# Altium schematic sheet 02_MSP430.SchDoc: Wearable Ultra Low-Power Ultrasound probe
size A3; DrawnBy: Sebastian Frey; Organization: Integrated Systems Laboratory; Revision: v1.2; SheetNumber: 3; SheetTotal: 6
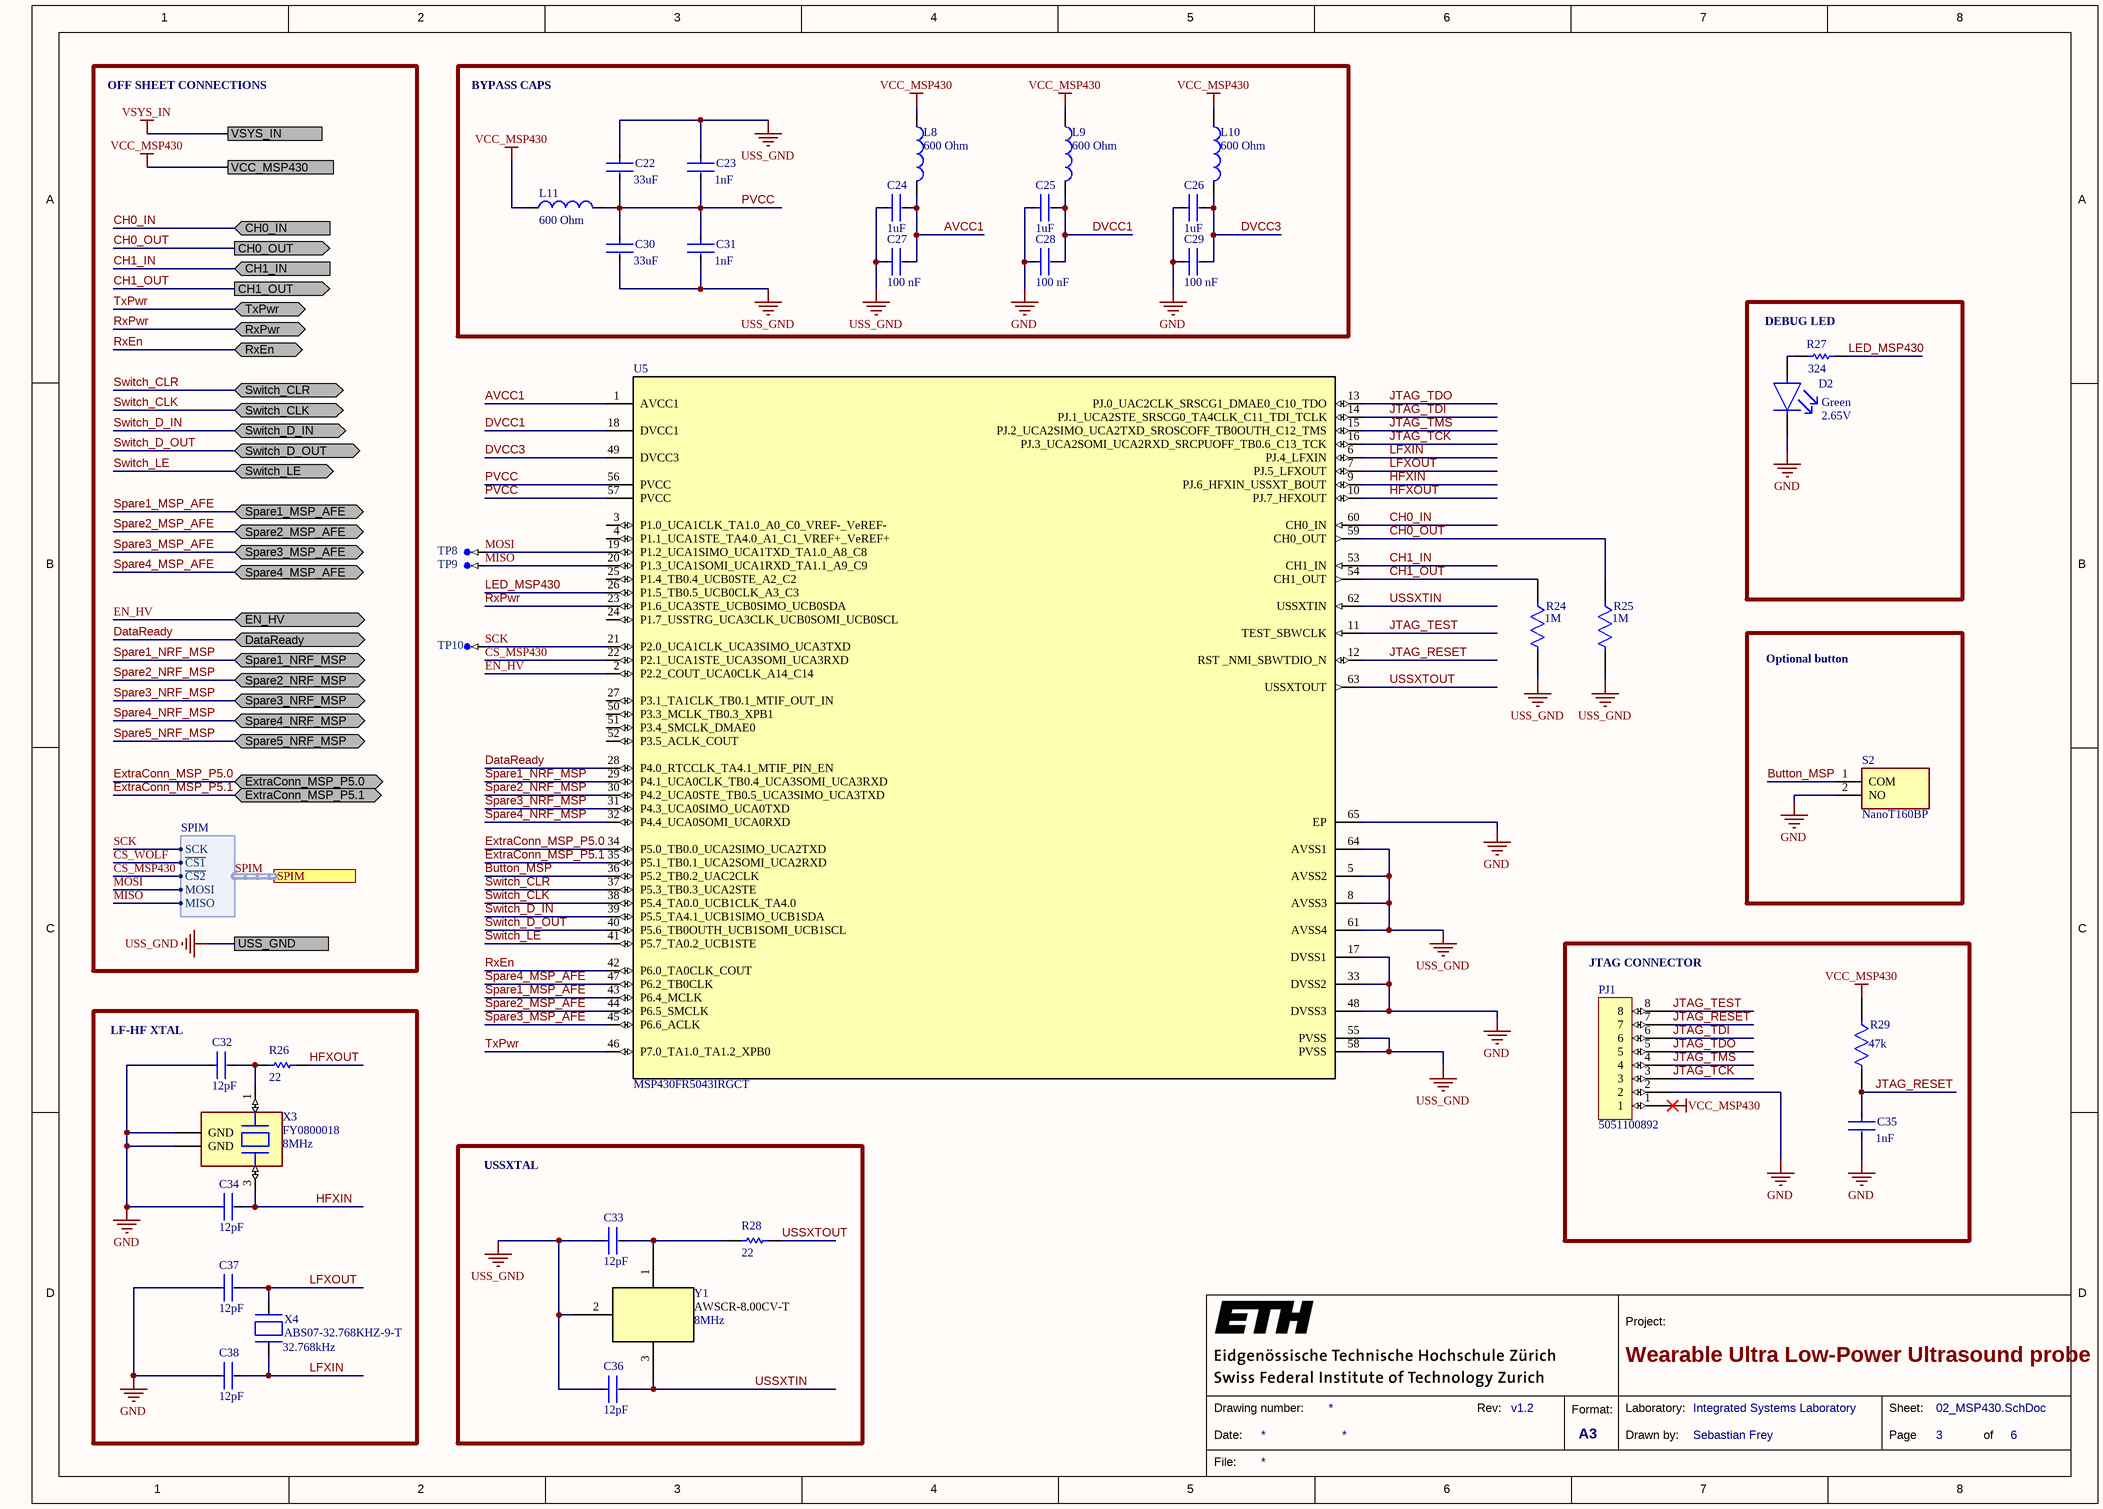
[diagram p0: 02_MSP430.SchDoc]

## Parts
C22  Capacitance: 33uF  [FP-C2012-125-0_2-IPC_A]  (hidden comment: C2012X5R1A336M125AC)
C23  Capacitance: 1nF  [FP-GRM155-0_05-IPC_B]  (hidden comment: GRM1555C1H102JA01D)
C24  Capacitance: 1uF  [FP-C1608-080-0_1-IPC_B]  (hidden comment: C1608X7R1C105K080AC)
C25  Capacitance: 1uF  [FP-C1608-080-0_1-IPC_B]  (hidden comment: C1608X7R1C105K080AC)
C26  Capacitance: 1uF  [FP-C1608-080-0_1-IPC_B]  (hidden comment: C1608X7R1C105K080AC)
C27  value 100 nF  [FP-CC0402-MFG]  (hidden comment: CC0402KRX7R7BB104)
C28  value 100 nF  [FP-CC0402-MFG]  (hidden comment: CC0402KRX7R7BB104)
C29  value 100 nF  [FP-CC0402-MFG]  (hidden comment: CC0402KRX7R7BB104)
C30  Capacitance: 33uF  [FP-C2012-125-0_2-IPC_A]  (hidden comment: C2012X5R1A336M125AC)
C31  Capacitance: 1nF  [FP-GRM155-0_05-IPC_B]  (hidden comment: GRM1555C1H102JA01D)
C32  Capacitance: 12pF  [FP-GJM155-0_05-IPC_A]  (hidden comment: GJM1555C1H120GB01D)
C33  Capacitance: 12pF  [FP-GJM155-0_05-IPC_A]  (hidden comment: GJM1555C1H120GB01D)
C34  Capacitance: 12pF  [FP-GJM155-0_05-IPC_A]  (hidden comment: GJM1555C1H120GB01D)
C35  Capacitance: 1nF  [FP-GRM155-0_05-IPC_B]  (hidden comment: GRM1555C1H102JA01D)
C36  Capacitance: 12pF  [FP-GJM155-0_05-IPC_A]  (hidden comment: GJM1555C1H120GB01D)
C37  Capacitance: 12pF  [FP-GJM155-0_05-IPC_A]  (hidden comment: GJM1555C1H120GB01D)
C38  Capacitance: 12pF  [FP-GJM155-0_05-IPC_A]  (hidden comment: GJM1555C1H120GB01D)
D2  Forward Voltage: 2.65V  Color: Green  [FP-APHD1608LZGCK-MFG]  (hidden comment: APHD1608LZGCK)
L8  Impedance: 600 Ohm  [SMD-0805]  (hidden comment: 742792040)
L9  Impedance: 600 Ohm  [SMD-0805]  (hidden comment: 742792040)
L10  Impedance: 600 Ohm  [SMD-0805]  (hidden comment: 742792040)
L11  Impedance: 600 Ohm  [SMD-0805]  (hidden comment: 742792040)
PJ1  5051100892  [MOLEX_5051100892]
R24  Resistance: 1M  [FP-CRCW0402-e3-MFG]  (hidden comment: CRCW04021M00FKED)
R25  Resistance: 1M  [FP-CRCW0402-e3-MFG]  (hidden comment: CRCW04021M00FKED)
R26  Resistance: 22  [RESC1005X40X25NL05T10]  (hidden comment: RC0402JR-0722RL)
R27  Resistance: 324  [RESC1005X35X20ML05T10]  (hidden comment: CPF0402B324RE1)
R28  Resistance: 22  [RESC1005X40X25NL05T10]  (hidden comment: RC0402JR-0722RL)
R29  Resistance: 47k  [FP-CRCW0402-e3-IPC_C]  (hidden comment: CRCW040247K0FKED)
S2  NanoT160BP  [NanoT160BP]
TP8  TP-SM-C-100  [TP-SM-C-100]  (value not drawn)  (no BOM)
TP9  TP-SM-C-100  [TP-SM-C-100]  (value not drawn)  (no BOM)
TP10  TP-SM-C-100  [TP-SM-C-100]  (value not drawn)  (no BOM)
U5  MSP430FR5043IRGCT  [RGC0064G]
X3  FY0800018  Frequency: 8MHz  [XTAL_ECS-80-18-30B-AGN-TR]
X4  ABS07-32.768KHZ-9-T  Frequency: 32.768kHz  [XTAL320X150X90]
Y1  Frequency: 8MHz  [AWSCR-8.00CV-T_ABR]  (hidden comment: AWSCR-8.00CV-T)

## Blocks framed on the sheet
BYPASS CAPS: C22-C31 L8-L11
DEBUG LED: D2 R27
Optional button: S2
JTAG CONNECTOR: C35 PJ1 R29
LF-HF XTAL: C32 C34 C37 C38 R26 X3 X4
USSXTAL: C33 C36 R28 Y1

## Ports
CH0_IN (in), CH0_OUT (out), CH1_IN (in), CH1_OUT (out), DataReady (bidir), EN_HV (bidir), ExtraConn_MSP_P5.0 (bidir), ExtraConn_MSP_P5.1 (bidir), RxEn (bidir), RxPwr (bidir), Spare1_MSP_AFE (bidir), Spare1_NRF_MSP (bidir), Spare2_MSP_AFE (bidir), Spare2_NRF_MSP (bidir), Spare3_MSP_AFE (bidir), Spare3_NRF_MSP (bidir), Spare4_MSP_AFE (bidir), Spare4_NRF_MSP (bidir), Spare5_NRF_MSP (bidir), SPIM (harness SPIM), Switch_CLK (bidir), Switch_CLR (bidir), Switch_D_IN (bidir), Switch_D_OUT (bidir), Switch_LE (bidir), TxPwr (bidir), USS_GND, VCC_MSP430, VSYS_IN

## Harnesses
SPIM: SCK, ~{CS1}, ~{CS2}, MOSI, MISO

## Nets
GND: C25.2 C26.2 C28.1 C29.1 C32.1 C34.1 C35.2 C37.1 C38.1 D2.1(C) PJ1.2 S2.2(NO) U5.17(DVSS1) U5.33(DVSS2) U5.48(DVSS3) U5.65(EP) X3.2(GND) X3.4(GND)
USS_GND: C22.1 C23.1 C24.2 C27.1 C30.2 C31.2 C33.1 C36.1 R24.2 R25.2 U5.5(AVSS2) U5.8(AVSS3) U5.55(PVSS) U5.58(PVSS) U5.61(AVSS4) U5.64(AVSS1) Y1.2 ; port USS_GND
VCC_MSP430: L8.1 L9.1 L10.1 L11.1 PJ1.1 R29.1 ; port VCC_MSP430
VSYS_IN: port VSYS_IN
AVCC1: C24.1 C27.2 L8.2 U5.1(AVCC1)
Button_MSP: S2.1(COM) U5.36(P5.2_TB0.2_UAC2CLK)
CH0_IN: U5.60(CH0_IN) ; port CH0_IN
CH0_OUT: R25.1 U5.59(CH0_OUT) ; port CH0_OUT
CH1_IN: U5.53(CH1_IN) ; port CH1_IN
CH1_OUT: R24.1 U5.54(CH1_OUT) ; port CH1_OUT
CS_MSP430: U5.22(P2.1_UCA1STE_UCA3SOMI_UCA3RXD) ; port SPIM.~{CS2}
CS_WOLF: port SPIM.~{CS1}
DataReady: U5.28(P4.0_RTCCLK_TA4.1_MTIF_PIN_EN) ; port DataReady
DVCC1: C25.1 C28.2 L9.2 U5.18(DVCC1)
DVCC3: C26.1 C29.2 L10.2 U5.49(DVCC3)
EN_HV: U5.2(P2.2_COUT_UCA0CLK_A14_C14) ; port EN_HV
ExtraConn_MSP_P5.0: U5.34(P5.0_TB0.0_UCA2SIMO_UCA2TXD) ; port ExtraConn_MSP_P5.0
ExtraConn_MSP_P5.1: U5.35(P5.1_TB0.1_UCA2SOMI_UCA2RXD) ; port ExtraConn_MSP_P5.1
HFXIN: C34.2 U5.9(PJ.6_HFXIN_USSXT_BOUT) X3.3(OUT/IN)
HFXOUT: R26.2 U5.10(PJ.7_HFXOUT)
JTAG_RESET: C35.1 PJ1.7 R29.2 U5.12(RST__NMI_SBWTDIO_N)
JTAG_TCK: PJ1.3 U5.16(PJ.3_UCA2SOMI_UCA2RXD_SRCPUOFF_TB0.6_C13_TCK)
JTAG_TDI: PJ1.6 U5.14(PJ.1_UCA2STE_SRSCG0_TA4CLK_C11_TDI_TCLK)
JTAG_TDO: PJ1.5 U5.13(PJ.0_UAC2CLK_SRSCG1_DMAE0_C10_TDO)
JTAG_TEST: PJ1.8 U5.11(TEST_SBWCLK)
JTAG_TMS: PJ1.4 U5.15(PJ.2_UCA2SIMO_UCA2TXD_SROSCOFF_TB0OUTH_C12_TMS)
LED_MSP430: R27.1 U5.26(P1.5_TB0.5_UCB0CLK_A3_C3)
LFXIN: C38.2 U5.6(PJ.4_LFXIN) X4.1
LFXOUT: C37.2 U5.7(PJ.5_LFXOUT) X4.2
MISO: TP9.1 U5.20(P1.3_UCA1SOMI_UCA1RXD_TA1.1_A9_C9) ; port SPIM.MISO
MOSI: TP8.1 U5.19(P1.2_UCA1SIMO_UCA1TXD_TA1.0_A8_C8) ; port SPIM.MOSI
PVCC: C22.2 C23.2 C30.1 C31.1 L11.2 U5.56(PVCC) U5.57(PVCC)
RxEn: U5.42(P6.0_TA0CLK_COUT) ; port RxEn
RxPwr: U5.23(P1.6_UCA3STE_UCB0SIMO_UCB0SDA) ; port RxPwr
SCK: TP10.1 U5.21(P2.0_UCA1CLK_UCA3SIMO_UCA3TXD) ; port SPIM.SCK
Spare1_MSP_AFE: U5.43(P6.4_MCLK) ; port Spare1_MSP_AFE
Spare1_NRF_MSP: U5.29(P4.1_UCA0CLK_TB0.4_UCA3SOMI_UCA3RXD) ; port Spare1_NRF_MSP
Spare2_MSP_AFE: U5.44(P6.5_SMCLK) ; port Spare2_MSP_AFE
Spare2_NRF_MSP: U5.30(P4.2_UCA0STE_TB0.5_UCA3SIMO_UCA3TXD) ; port Spare2_NRF_MSP
Spare3_MSP_AFE: U5.45(P6.6_ACLK) ; port Spare3_MSP_AFE
Spare3_NRF_MSP: U5.31(P4.3_UCA0SIMO_UCA0TXD) ; port Spare3_NRF_MSP
Spare4_MSP_AFE: U5.47(P6.2_TB0CLK) ; port Spare4_MSP_AFE
Spare4_NRF_MSP: U5.32(P4.4_UCA0SOMI_UCA0RXD) ; port Spare4_NRF_MSP
Spare5_NRF_MSP: port Spare5_NRF_MSP
Switch_CLK: U5.38(P5.4_TA0.0_UCB1CLK_TA4.0) ; port Switch_CLK
Switch_CLR: U5.37(P5.3_TB0.3_UCA2STE) ; port Switch_CLR
Switch_D_IN: U5.39(P5.5_TA4.1_UCB1SIMO_UCB1SDA) ; port Switch_D_IN
Switch_D_OUT: U5.40(P5.6_TB0OUTH_UCB1SOMI_UCB1SCL) ; port Switch_D_OUT
Switch_LE: U5.41(P5.7_TA0.2_UCB1STE) ; port Switch_LE
TxPwr: U5.46(P7.0_TA1.0_TA1.2_XPB0) ; port TxPwr
USSXTIN: C36.2 U5.62(USSXTIN) Y1.3
USSXTOUT: R28.2 U5.63(USSXTOUT)
NetC32_2: C32.2 R26.1 X3.1(IN/OUT)
NetC33_2: C33.2 R28.1 Y1.1
NetD2_2: D2.2(A) R27.2

Not connected (* = marked no-connect by the designer): U5 3(P1.0_UCA1CLK_TA1.0_A0_C0_VREF-_VeREF-) 4(P1.1_UCA1STE_TA4.0_A1_C1_VREF+_VeREF+) 24(P1.7_USSTRG_UCA3CLK_UCB0SOMI_UCB0SCL) 25(P1.4_TB0.4_UCB0STE_A2_C2) 27(P3.1_TA1CLK_TB0.1_MTIF_OUT_IN) 50(P3.3_MCLK_TB0.3_XPB1) 51(P3.4_SMCLK_DMAE0) 52(P3.5_ACLK_COUT)

## Buses and harness runs
harness SPIM = port SPIM

## Notes on the sheet
- OFF SHEET CONNECTIONS
- 1
- 2
- 3
- 4
- 5
- 6
- 7
- 8
- A
- B
- C
- D
- Project:
- Date:
- Drawing number:
- Rev:
- Format:
- A3
- Drawn by:
- Laboratory:
- Page
- Sheet:
- of
- File:

## Library data of the parts
C22 C30 = CMP-08246-002720-1: Multilayer Ceramic Capacitors 33μF ±20% 10V X5R SMD 0805; Dielectric: X5R; Series: C; Packaging: Tape and Reel; Voltage Rating: 10V; Height: 1.25mm; Tolerance: 20%; Thickness: 0.057inch; Min Operating Temperature: -55°C; Max Operating Temperature: 85°C; Case Code (Imperial): 0805; Voltage Rating (DC): 10V; Case Code (Metric): 2012; Length: 2mm; REACH SVHC: No SVHC; Depth: 1.25mm; Package Quantity: 1; Dielectric Material: Ceramic; Lead Free: Lead Free; Case/Package: 0805; Termination: SMD/SMT; Resistor Type: Ceramic; RoHS Compliant: Yes; Width: 0.049inch; Weight: 0.000194oz; Mount: Surface Mount
C23 C31 C35 = CMP-2008-04254-2: Chip Multilayer Ceramic Capacitors for General Purpose, 0402, 1000pF, C0G, 30ppm/°C, 5%, 50V; Insulation Resistance: 10GR; Packaging: Tape and Reel; Lead Free: Lead Free; Tolerance: 5%; Temperature Coefficient: 30ppm/°C; Thickness: 0.022inch; Termination: SMD/SMT; Max Operating Temperature: 125°C; Height: 0.5mm; Package Quantity: 1; Radiation Hardening: No; Material: Ceramic; Case Code (Metric): 1005; Number of Pins: 2; Voltage Rating: 50V; Mount: Surface Mount; Voltage: 50V; Case/Package: 0402; Min Operating Temperature: -55°C; Dielectric Material: Ceramic; Width: 0.5mm; Depth: 0.5mm; Case Code (Imperial): 0402; REACH SVHC: No SVHC; Dielectric: C0G; Voltage Rating (DC): 50V; Length: 1mm
C24-C26 = CMP-08246-002727-1: Multilayer Ceramic Capacitors 1μF ±10% 16V X7R SMD 0603; Mount: Surface Mount; Width: 0.031inch; Radiation Hardening: No; Dielectric Material: Ceramic; Packaging: Tape and Reel; Voltage Rating: 16V; Weight: 7.1E-05oz; Termination: SMD/SMT; Package Quantity: 1; Voltage Rating (DC): 16V; REACH SVHC: No SVHC; Voltage: 16V; Min Operating Temperature: -55°C; Depth: 0.8mm; Height: 0.8mm; Length: 1.6mm; Case Code (Metric): 1608; Thickness: 0.037inch; Lead Free: Lead Free; Resistor Type: Ceramic; RoHS Compliant: Yes; Series: C; Construction: Flat; Max Operating Temperature: 125°C; Tolerance: 10%; Case/Package: 0603; Dielectric: X7R; Case Code (Imperial): 0603
C27-C29 = CMP-03422-000048-1: CAP CER 0.1UF 16V X7R 0402; Manufacturer: YAGEO; Material: Ceramic; Automotive Grade: NA; Temperature Coefficient: 30ppm/°C; Tolerance: 0.1; Device Class L1: Passive Components; Temperature Range Low: -55°C; Device Class L3: Ceramic Capacitors; Temperature Characteristic: X7R; Ipc Land Pattern Name: CAPC10050X50; Capacitance: 100 nF; Temperature Range High: +125°C; Voltage Rating: 16 V; Temperature: -55°C to +125°C; RoHS: TRUE; Automotive: No; Height: 0.55mm; Device Class L2: Capacitors; Digikey Description: CAP CER 0.1UF 16V X7R 0402; Package: CC0402; Footprint Url: http://www.yageo.com/exep/pages/download/literatures/UPY-C_GEN_24.pdf; ComponentLink2Description: Datasheet; Category: Cap; Lead Free: Yes; Octopart: https://octopart.com/cc0402krx7r7bb104-yageo-42244624; ComponentLink2URL: http://www.yageo.com/documents/recent/UPY-GP_NP0_16V-to-50V_16.pdf; Manufacturer Part Number: CC0402KRX7R7BB104; Mouser Description: 0402 0.1 uF 16 V ±10 % Tolerance X7R SMT Multilayer Ceramic Capacitor
C32-C34 C36-C38 = CMP-2008-03799-2: Multi-Layer Ceramic Capacitor 12pF C0G  ±2% 0402 Paper T/R; Voltage Rating: 50V; Tolerance: 2%; Length: 1mm; Width: 0.5mm; Thickness: 0.022inch; Package Quantity: 10000; Lead Free: Lead Free; Mount: Surface Mount; Voltage Rating (DC): 50V; Max Operating Temperature: 125°C; Termination: SMD/SMT; Depth: 0.5mm; Min Operating Temperature: -55°C; Height: 0.5mm; Case Code (Imperial): 0402; Case/Package: 0402; Case Code (Metric): 1005; Dielectric: C0G; Packaging: Tape and Reel; Radiation Hardening: No
D2 = CMP-44529-000045-1: LED GREEN CLEAR 1608 SMD; Test Current: 2mA; Dominant Wavelength: 525nm; Lens Color: Colorless; Luminous Intensity: 180mcd; Viewing Angle: 100°; Lens Size: 0.7mm; Lens Style: Round; Mount: Surface Mount; Packaging: Tape and Reel; Lens Transparency: Clear; Height: 0.75mm; Case/Package: 0603; Length: 1.6mm; Case Code (Metric): 1608; Width: 0.8mm; Case Code (Imperial): 0603
L8-L11 = CMP-0220-00032-1: SMD EMI Suppression Ferrite Bead WE-CBF, Z = 600 Ohm; PackageVersion: 2005; ComponentLink2Description: Datasheet; PackageDescription: Chip Inductor, 2-Leads, Body 2.0 x 1.2 mm; ComponentLink1URL: http://www.we-online.com; PackageReference: SMD-0805; DatasheetVersion: Dec-2005; ComponentLink2URL: http://www.we-online.de/katalog/media/pdf/742792040.pdf; ComponentLink1Description: Manufacturer Link
PJ1 = MOLEX_5051100892
R24 R25 = CMP-2002-08314-2: RES Thick Film, 1MΩ, 1%, 0.063W, 100ppm/°C, 0402; Power Rating: 63mW; Voltage Rating (DC): 50V; Min Operating Temperature: -55°C; Lead Free: Lead Free; Case Code (Imperial): 0402; Packaging: Tape and Reel; Case Code (Metric): 1005; Tolerance: 1%; Number of Terminations: 2; Features: Automotive AEC-Q200; Number of Pins: 2; Max Power Dissipation: 63mW; Height: 0.35mm; Weight: 2.3E-05oz; Package Quantity: 10; Contact Plating: Tin; Temperature Coefficient: 100ppm/°C; Radiation Hardening: No; Length: 1mm; Termination: SMD/SMT; Depth: 0.5mm; Case/Package: 0402; Voltage Rating: 50V; Composition: Thick Film; Width: 0.02inch; Max Operating Temperature: 155°C; Military Standard: Not
R26 R28 = CMP-2002-07961-1: Manufacturer: Yageo / Phycomp; Part Number: RC0402JR-0722RL
R27 = CMP-2002-03257-1: Manufacturer: TE Connectivity / AMP; Part Number: CPF0402B324RE1
R29 = CMP-02407-007705-1: RES Thick Film, 47kΩ, 1%, 0.063W, 100ppm/°C, 0402; Voltage Rating (DC): 50V; Power Rating: 63mW; Temperature Coefficient: 100ppm/°C; Mount: Surface Mount; Radiation Hardening: No; Case Code (Imperial): 0402; Case Code (Metric): 1005; Contact Plating: Tin; Case/Package: 0402; Package Quantity: 10000; Width: 0.5mm; Lead Free: Lead Free; Packaging: Tape and Reel; Length: 1mm; Max Operating Temperature: 155°C; Min Operating Temperature: -55°C; Tolerance: 1%; Weight: 2.3E-05oz; Working Voltage: 50V; Voltage Rating: 50V; Height: 0.35mm; Depth: 0.5mm; Composition: Thick Film; Number of Terminations: 2; Termination: SMD/SMT; Military Standard: Not
S2 = NanoT160BP: Switch; Manufacturer_Name: LITTELFUSE; Datasheet Link: https://www.ckswitches.com/media/2866/nanot.pdf; Height: 1mm; Manufacturer_Part_Number: NanoT160BP
TP8-TP10 = CMP-0484-00002-1: Test Point, Surface Mount, Circular, Pad Diameter 1 mm
U5 = MSP430FR5043IRGCT: No Description Available; Mfr_Name: Texas Instruments; Type: DEV; RefDes: RefDes; Copyright: Copyright (C) 2021 Ultra Librarian. All rights reserved.; Manufacturer_Part_Number: MSP430FR5043IRGCT
X3 = FY0800018: Crystal 8MHz ±30ppm (Tol) ±30ppm (Stability) 18pF FUND 100Ohm 4-Pin SMD T/R; Manufacturer: Diodes; ESR (Equivalent Series Resistance): 100R; Supplier 1: Digi-Key; Manufacturer Part Number: FY0800018; RoHS: Yes; Category: Crystals; Stock 1: 10869; Pricing 1: 1=0.80000, 10=0.70800, 50=0.66220, 100=0.58520, 500=0.55440 (USD); Mount: Surface Mount; Case/Package: SMD/SMT; Min Operating Temperature: -40°C; Max Operating Temperature: 85°C; Packaging: Cut Tape; Frequency Stability: 30ppm; Frequency Tolerance: 30ppm; Load Capacitance: 18pF; Length: 0.197inch; Width: 0.126inch; Height: 0.043inch; ComponentLink1URL: http://media.digikey.com/pdf/Data%20Sheets/Pericom%20PDFs/FY0800018_VerB.pdf?src-supplier=Digi-Key; ComponentLink1Description: http://media.digikey.com/pdf/Data%20Sheets/Pericom%20PDFs/FY0800018_VerB.pdf?src-supplier=Digi-Key; Supplier Part Number 1: FY0800018CT-ND
X4 = ABS07-32.768KHZ-9-T: Crystal; Miniature; 3.2 x 1.5 x 0.9mm; 32.768KHZ; 9pf; 20ppm -40+85C; SMD; T/R; Manufacturer: Abracon; ESR (Equivalent Series Resistance): 70kR; Insulation Resistance: 500MR; Supplier 1: Digi-Key; Manufacturer Part Number: ABS07-32.768KHZ-9-T; RoHS: Yes; Category: Crystals; Stock 1: 83876; Pricing 1: 1=1.36000, 10=1.30000, 50=1.27000, 100=1.08860, 500=1.05840, 1000=0.89208 (USD); Mount: Surface Mount; Case/Package: CSMD; Number of Pins: 2; Min Operating Temperature: -40°C; Max Operating Temperature: 85°C; Load Capacitance: 9pF; Packaging: Tape and Reel; Frequency Tolerance: 20ppm; Package Quantity: 3000; Tolerance: 20ppm; Frequency Stability: 20ppm; Termination: SMD/SMT; Series Resistance: 70kR; Series: ABS07; Operating Frequency: 32.768 kHz; Length: 3.2mm; Width: 1.5mm; Height: 0.035inch; Depth: 1.5mm; Radiation Hardening: No; RoHS Compliant: Yes; REACH SVHC: No SVHC; Lead Free: Lead Free; ComponentLink1URL: https://datasheet.ciiva.com/855/abs07-855948.pdf?src-supplier=Digi-Key; ComponentLink1Description: https://datasheet.ciiva.com/855/abs07-855948.pdf?src-supplier=Digi-Key; Supplier Part Number 1: 535-9544-1-ND
Y1 = AWSCR-8.00CV-T: No Description Available; Mfr_Name: Abracon; Copyright: Copyright (C) 2021 Ultra Librarian. All rights reserved.; RefDes: RefDes; Type: DEV; Manufacturer_Part_Number: AWSCR-8.00CV-T